# EAGLE design FET drive (EAGLE 7.1.0)
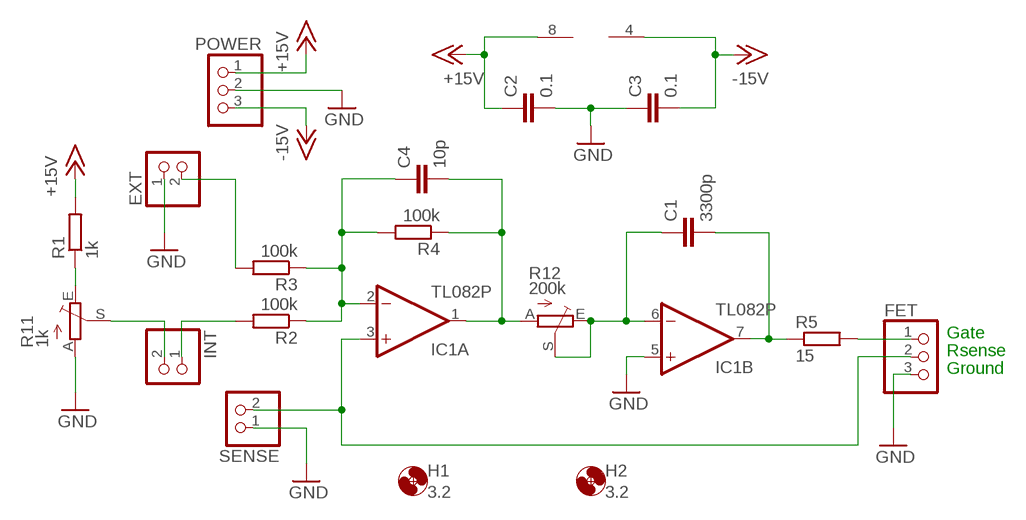
[diagram p0: schematic, sheet 1]

## Parts
C1  3300p  C-EU025-025X050  [C025-025X050]
C2  0.1  C-EU025-025X050  [C025-025X050]
C3  0.1  C-EU025-025X050  [C025-025X050]
C4  10p  C-EU025-025X050  [C025-025X050]
EXT  PINHD-1X2  [1X02]
FET  PINHD-1X3  [1X03]
H1  3.2  MOUNT-HOLE3.2  [3,2]
H2  3.2  MOUNT-HOLE3.2  [3,2]
IC1  TL082P  [DIL08]
INT  PINHD-1X2  [1X02]
POWER  PINHD-1X3  [1X03]
R1  1k  R-EU_R0805  [R0805]
R2  100k  R-EU_R0805  [R0805]
R3  100k  R-EU_R0805  [R0805]
R4  100k  R-EU_R0805  [R0805]
R5  15  R-EU_0204/5  [0204/5]
R11  1k  TRIM_EU-B25P  [B25P]
R12  200k  TRIM_EU-B25P  [B25P]
SENSE  PINHD-1X2  [1X02]

## Nets
+15V: C2.1 IC1.8(P:V+) POWER.1 R1.2
-15V: C3.2 IC1.4(P:V-) POWER.3
GND: C2.2 C3.1 EXT.1 FET.3 IC1.5(B:+IN) POWER.2 R11.A SENSE.1
N$1: R1.1 R11.E
N$2: INT.2 R11.S
N$3: INT.1 R2.2
N$4: EXT.2 R3.2
N$5: C4.1 IC1.2(A:-IN) R2.1 R3.1 R4.2
N$9: C4.2 IC1.1(A:OUT) R4.1 R12.A
N$10: C1.1 IC1.6(B:-IN) R12.E R12.S
N$11: C1.2 IC1.7(B:OUT) R5.1
N$12: FET.1 R5.2
N$13: FET.2 IC1.3(A:+IN) SENSE.2

## Notes on the sheet
- Gate
- Rsense
- Ground

## Library data of the parts
C1-C4 = rcl:C-EU: CAPACITOR, European symbol
EXT INT SENSE = pinhead:PINHD-1X2: PIN HEADER
FET POWER = pinhead:PINHD-1X3: PIN HEADER
H1 H2 = holes:MOUNT-HOLE: MOUNTING HOLE with drill center marker
IC1 = linear:TL082: OP AMP Data sheet <http://www.ti.com/lit/ds/symlink/tl084a . pdf>; DATA_SHEET: <a href="http://www.ti.com/lit/ds/symlink/tl084a.pdf"> Data sheet </a>
R1-R5 = rcl:R-EU_: RESISTOR, European symbol
R11 R12 = pot:TRIM_EU-: POTENTIOMETER

## Board
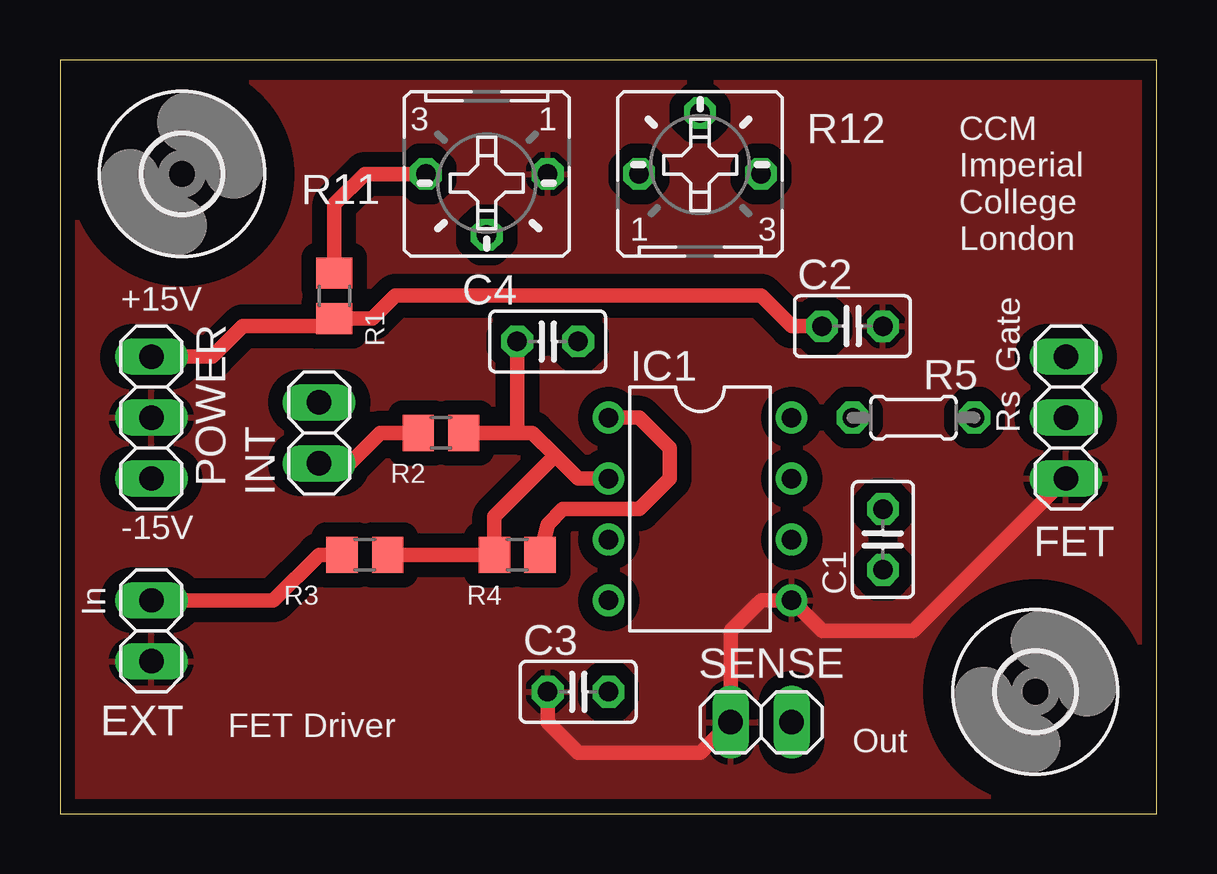
[diagram p1: board, top side]
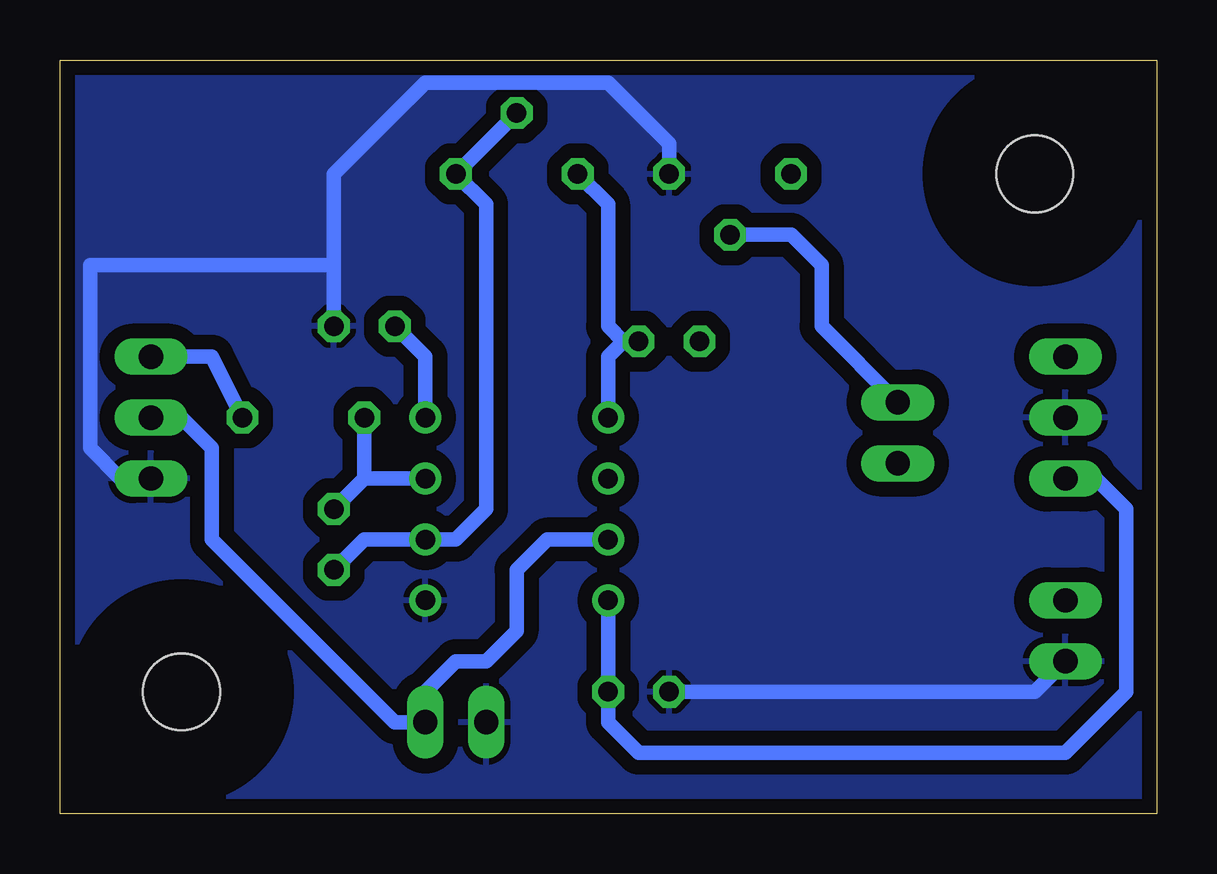
[diagram p2: board, bottom side, seen from below]

Size 45.7 x 31.42 mm. Coordinates in mm from the lower left corner, seen from the top.
Outline: 0,0 45.7,0 45.7,31.42 0,31.42 0,0
Copper layers (1*16): Top 0.035mm / dielectric 1.5mm / Bottom 0.035mm
Design rules "dirt_cheap_dirty_boards.v1": minimum track width 5mil, minimum drill 12mil, track to track 5mil, track to pad 5mil, pad to pad 5mil, via to via 5mil, smd to smd 0mil, copper to edge 10mil, drill to drill 10mil, minimum pad ring 10mil, minimum via ring 6mil, stop-mask expansion 2mil, vias tented up to drill 25mil, thermal gap 10mil

### Footprints (pad centres in the part's own frame; a part is rotated, then mirrored left to right if it is on the bottom)
C025-025X050 = drill 0.813 octagon: 1 -1.27,0; 2 1.27,0
1X02 = drill 1.016 long: 1 -1.27,0; 2 1.27,0
1X03 = drill 1.016 long: 1 -2.54,0; 2 0,0; 3 2.54,0
3,2 = hole 3.2: 0,0
DIL08 = drill 0.813 pad 1.27: 1 -3.81,-3.81; 2 -1.27,-3.81; 3 1.27,-3.81; 4 3.81,-3.81; 5 3.81,3.81; 6 1.27,3.81; 7 -1.27,3.81; 8 -3.81,3.81
R0805 = smd 1.3 x 1.5: 1 -0.95,0; 2 0.95,0
0204/5 = drill 0.813 octagon: 1 -2.54,0; 2 2.54,0
B25P = drill 0.813 octagon: A -2.54,0; E 2.54,0; S 0,2.54

### Placement (x,y rotation side)
C1  34.29,11.43 90 top
C2  33.02,20.32 0 top
C3  21.59,5.08 0 top
C4  20.32,19.69 0 top
EXT  3.81,7.62 90 top
FET  41.91,16.51 270 top
H1  5.08,26.67 0 top
H2  40.64,5.08 0 top
IC1  26.67,12.7 270 top
INT  10.79,15.88 90 top
POWER  3.81,16.51 270 top
R1  11.43,21.59 270 top
R2  15.88,15.88 180 top
R3  12.7,10.8 180 top
R4  19.05,10.8 180 top
R5  35.56,16.51 0 top
R11  17.78,26.67 180 top
R12  26.67,26.67 0 top
SENSE  29.21,3.81 0 top

### Tracks (layer width: path | path; a pad name or v marks a point on that pad's centre or on a via)
+15V
  Top 0.61: C2.1 30.48,20.32 29.21,21.59 13.97,21.59 13.02,20.64 R1.2 11.11,20.32 7.62,20.32 6.35,19.05 POWER.1
  Bottom 0.61: C2.1 30.48,19.05 IC1.8
-15V
  Bottom 0.61: IC1.4 C3.2 22.86,3.81 21.59,2.54 3.81,2.54 1.27,5.08 1.27,12.7 2.54,13.97 POWER.3
GND
  Top 0.61: C3.1 20.32,3.81 21.59,2.54 26.67,2.54 SENSE.1 27.94,7.62 29.21,8.89 IC1.5 31.75,7.62 35.56,7.62 FET.3
  Bottom 0.61: C3.1 5.08,5.08 EXT.1 | R11.A 20.32,27.94 22.86,30.48 30.48,30.48 34.29,26.67 34.29,22.86 | 34.29,22.86 C2.2 | FET.3 43.18,13.97 44.45,15.24 44.45,22.86 34.29,22.86
  pour Top (isolate 0.61): 0,0 0,30.48 45.72,30.48 45.72,0
  pour Bottom (isolate 0.61): 0,0 0,31.12 45.72,31.12 45.72,0
N$1
  Top 0.61: R11.E 12.7,26.67 11.43,25.4 R1.1
N$2
  Bottom 0.61: R11.S 15.24,24.13 13.97,22.86 13.97,20.32 INT.2
N$3
  Top 0.61: R2.2 13.34,15.88 12.06,14.61 INT.1
N$4
  Top 0.61: R3.2 10.79,10.8 8.89,8.89 EXT.2
N$5
  Top 0.61: R3.1 R4.2 18.1,12.39 20.64,14.92 | IC1.2 21.59,13.97 20.64,14.92 | 20.64,14.92 19.68,15.88 19.05,15.88 | 19.05,15.88 R2.1 | C4.1 19.05,15.88
N$9
  Top 0.61: R4.1 20.32,12.07 20.95,12.7 24.13,12.7 25.4,13.97 25.4,15.24 24.13,16.51 IC1.1
  Bottom 0.61: IC1.1 22.86,19.05 22.23,19.69 | 22.23,19.69 C4.2 | R12.A 22.86,25.4 22.86,20.32 22.23,19.69
N$10
  Bottom 0.61: C1.1 33.02,11.43 IC1.6 29.21,11.43 27.94,12.7 27.94,25.4 R12.E R12.S
N$11
  Bottom 0.61: C1.2 33.02,13.97 | 33.02,13.97 IC1.7 | R5.1 33.02,15.24 33.02,13.97
N$12
  Bottom 0.61: FET.1 39.37,19.05 R5.2
N$13
  Bottom 0.61: FET.2 40.64,16.51 39.37,15.24 39.37,11.43 31.75,3.81 SENSE.2 30.48,5.08 29.21,6.35 27.94,6.35 26.67,7.62 26.67,10.16 25.4,11.43 IC1.3

### Text on the board
tNames: CCM / Imperial / College / London | +15V | Gate | Rs | -15V | In | FET Driver | Out